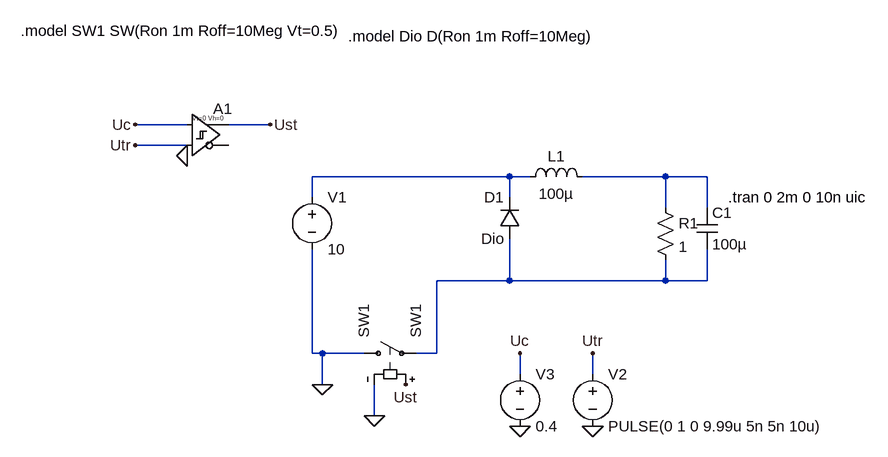
[diagram p0: schematic Tiefsetzsteller_Simulation.asc]
Tiefsetzsteller_Simulation.asc, the LTspice schematic file:
Version 4
SHEET 1 880 680
WIRE -288 112 -368 112
WIRE -160 112 -224 112
WIRE -288 144 -368 144
WIRE 208 192 -96 192
WIRE 240 192 208 192
WIRE 448 192 320 192
WIRE 512 192 448 192
WIRE -96 224 -96 192
WIRE 208 224 208 192
WIRE 448 240 448 192
WIRE 512 240 512 192
WIRE 208 352 208 288
WIRE 208 352 96 352
WIRE 448 352 448 320
WIRE 448 352 208 352
WIRE 512 352 512 304
WIRE 512 352 448 352
WIRE -96 464 -96 304
WIRE -80 464 -96 464
WIRE -16 464 -80 464
WIRE 96 464 96 352
WIRE 96 464 64 464
WIRE 224 496 224 464
WIRE 336 496 336 464
WIRE -80 512 -80 464
WIRE 0 560 0 512
FLAG 48 512 Ust
FLAG 0 560 0
FLAG 336 464 Utr
FLAG 336 576 0
FLAG -80 512 0
FLAG -368 112 Uc
FLAG -368 144 Utr
FLAG -288 160 0
FLAG -160 112 Ust
FLAG 224 576 0
FLAG 224 464 Uc
SYMBOL voltage -96 208 R0
SYMATTR InstName V1
SYMATTR Value 10
SYMBOL diode 224 288 R180
WINDOW 0 24 64 Left 2
WINDOW 3 24 0 Left 2
SYMATTR InstName D1
SYMATTR Value Dio
SYMBOL ind 224 208 R270
WINDOW 0 32 56 VTop 2
WINDOW 3 5 56 VBottom 2
SYMATTR InstName L1
SYMATTR Value 100µ
SYMBOL res 432 224 R0
SYMATTR InstName R1
SYMATTR Value 1
SYMBOL sw -32 464 R270
SYMATTR InstName SW1
SYMATTR Value SW1
SYMBOL voltage 336 480 R0
SYMATTR InstName V2
SYMATTR Value PULSE(0 1 0 9.99u 5n 5n 10u)
SYMBOL cap 496 240 R0
SYMATTR InstName C1
SYMATTR Value 100µ
SYMBOL Digital/diffschmitt -288 64 R0
WINDOW 3 8 38 Left 0
SYMATTR InstName A1
SYMATTR Value Vt=0 Vh=0
SYMBOL voltage 224 480 R0
SYMATTR InstName V3
SYMATTR Value 0.4
TEXT 544 224 Left 2 !.tran 0 2m 0 10n uic
TEXT -40 -24 Left 2 !.model Dio D(Ron 1m Roff=10Meg)
TEXT -544 -32 Left 2 !.model SW1 SW(Ron 1m Roff=10Meg Vt=0.5)

The netlist it stands for:
* Tiefsetzsteller_Simulation.asc
V1 N001 0 10
D1 N003 N001 Dio
L1 N001 N002 100µ
R1 N002 N003 1
SW1 0 N003 Ust 0 SW1
V2 Utr 0 PULSE(0 1 0 9.99u 5n 5n 10u)
C1 N002 N003 100µ
A1 Uc Utr 0 0 0 0 Ust 0 SCHMITT Vt=0 Vh=0
V3 Uc 0 0.4
.model D D
.lib standard.dio
.tran 0 2m 0 10n uic
.model Dio D(Ron 1m Roff=10Meg)
.model SW1 SW(Ron 1m Roff=10Meg Vt=0.5)
.backanno
.end